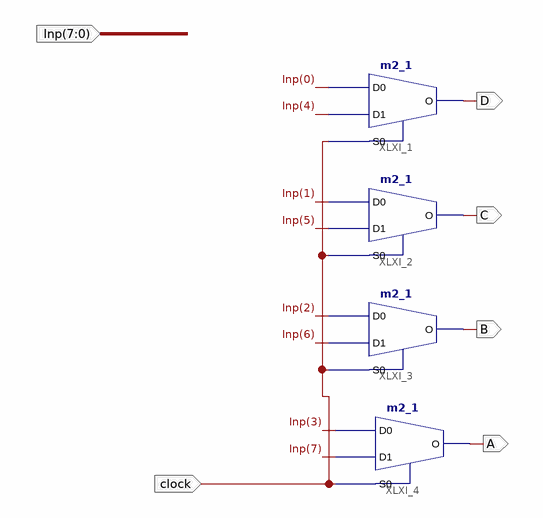
[diagram p0: schematic sheet 1]
// Xilinx ISE schematic Mux8_4.sch (spartan6) as structural Verilog: 4 symbols, 6 ports
module Mux8_4 (
  input  clock,
  input  [7:0] Inp,
  output D,
  output C,
  output B,
  output A
);

  m2_1 XLXI_1 (.D0(Inp[0]), .D1(Inp[4]), .S0(clock), .O(D));
  m2_1 XLXI_2 (.D0(Inp[1]), .D1(Inp[5]), .S0(clock), .O(C));
  m2_1 XLXI_3 (.D0(Inp[2]), .D1(Inp[6]), .S0(clock), .O(B));
  m2_1 XLXI_4 (.D0(Inp[3]), .D1(Inp[7]), .S0(clock), .O(A));
endmodule
